# Altium project CapProtector.PrjPCB
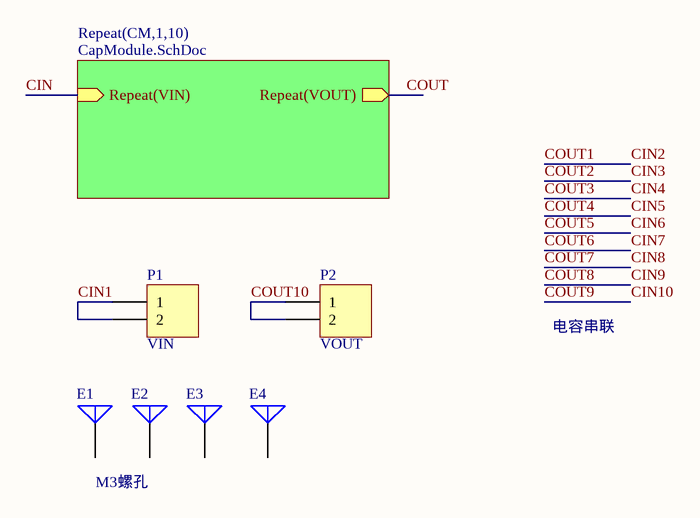
[diagram p0: CapProtector.SchDoc]
2 sheets, 116 parts. Net scope: hierarchical (ports join the sheet entries above them; power ports are global).
Board file: CapProtector.PcbDoc
Sheets:
  CapProtector.SchDoc
    CM1 = CapModule.SchDoc
    CM2 = CapModule.SchDoc
    CM3 = CapModule.SchDoc
    CM4 = CapModule.SchDoc
    CM5 = CapModule.SchDoc
    CM6 = CapModule.SchDoc
    CM7 = CapModule.SchDoc
    CM8 = CapModule.SchDoc
    CM9 = CapModule.SchDoc
    CM10 = CapModule.SchDoc

## Sheet CapProtector.SchDoc
size A4

### Parts
E1  Antenna  [M3x4_N]  (value not drawn)
E2  Antenna  [M3x4_N]  (value not drawn)
E3  Antenna  [M3x4_N]  (value not drawn)
E4  Antenna  [M3x4_N]  (value not drawn)
P1  VIN  [XT30U-M]
P2  VOUT  [XT30U-F]

### Sub-sheets
Repeat(CM,1,10) = CapModule.SchDoc: Repeat(VIN) (in), Repeat(VOUT) (out)

### Nets
CIN: sheet Repeat(CM,1,10)/Repeat(VIN)
CIN1: P1.1 P1.2
COUT: sheet Repeat(CM,1,10)/Repeat(VOUT)
COUT10: P2.1 P2.2

Not connected (* = marked no-connect by the designer): E1 1(A); E2 1(A); E3 1(A); E4 1(A)

### Notes on the sheet
- 电容串联
- M3螺孔

### Library data of the parts
E1-E4 = Antenna: Generic Antenna; Published: 24-Mar-1999; LatestRevisionDate: 17-Jul-2002; LatestRevisionNote: Re-released for DXP Platform.; PackageReference: PIN1; Publisher: Altium Limited
P1 P2 = Header 2: Header, 2-Pin; LatestRevisionDate: 17-Jul-2002; LatestRevisionNote: Re-released for DXP Platform.; Publisher: Altium Limited

## Sheet CapModule.SchDoc
size A4
Used 10 times, as channels CM1, CM2, CM3, CM4, CM5, CM6, CM7, CM8, CM9, CM10. Parts and nets are listed once, with the designators drawn on the sheet.
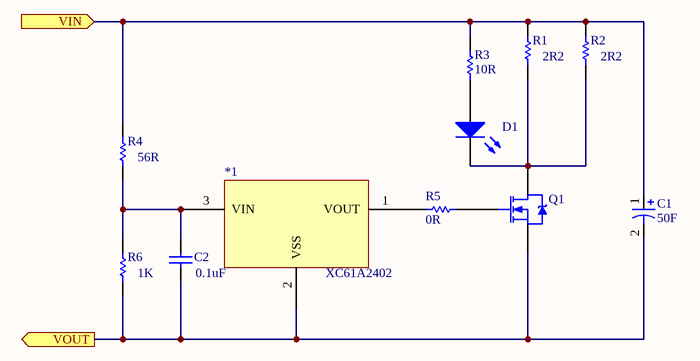
[diagram p1: CapModule.SchDoc]

### Parts
*1  XC61A2402  [SOT23-3N]
C1  value 50F  [CAP 7.5*18*35.5 - GD]  (hidden comment: Cap Pol1)
C2  value 0.1uF  [0603C]  (hidden comment: Cap)
D1  LED0  [LED 0603B]  (value not drawn)
Q1  NMOS-2  [sot23]  (value not drawn)
R1  value 2R2  [2512R]  (hidden comment: Res1)
R2  value 2R2  [2512R]  (hidden comment: Res1)
R3  value 10R  [0603R]  (hidden comment: Res1)
R4  value 56R  [0603R]  (hidden comment: Res1)
R5  value 0R  [0603R]  (hidden comment: Res1)
R6  value 1K  [0603R]  (hidden comment: Res1)

### Ports
VIN (in), VOUT (out)

### Nets
VIN: C1.1 R1.2 R2.2 R3.1 R4.2 ; port VIN
VOUT: *1.2(VSS) C1.2 C2.1 Q1.3(S) R6.1 ; port VOUT
Net*1_1: *1.1(VOUT) R5.2
Net*1_3: *1.3(VIN) C2.2 R4.1 R6.2
NetD1_1: D1.1(A) R3.2
NetD1_2: D1.2(K) Q1.2(D) R1.1 R2.1
NetQ1_1: Q1.1(G) R5.1

### Channels
CM1: designators end in A; ports VIN=CIN1 VOUT=CIN2
CM2: designators end in B; ports VIN=CIN2 VOUT=CIN3
CM3: designators end in C; ports VIN=CIN3 VOUT=CIN4
CM4: designators end in D; ports VIN=CIN4 VOUT=CIN5
CM5: designators end in E; ports VIN=CIN5 VOUT=CIN6
CM6: designators end in F; ports VIN=CIN6 VOUT=CIN7
CM7: designators end in G; ports VIN=CIN7 VOUT=CIN8
CM8: designators end in H; ports VIN=CIN8 VOUT=CIN9
CM9: designators end in I; ports VIN=CIN9 VOUT=CIN10
CM10: designators end in J; ports VIN=CIN10 VOUT=COUT10

### Library data of the parts
*1 = XC61A
C1 = Cap Pol1: Polarized Capacitor (Radial) 2.7v; Published: 8-Jun-2000; LatestRevisionDate: 17-Jul-2002; LatestRevisionNote: Re-released for DXP Platform.; PackageReference: RB7.6-15; Publisher: Altium Limited; PackageDescription: Polarized Capacitor (Radial); 2 Leads
C2 = Cap: Capacitor; Published: 8-Jun-2000; LatestRevisionDate: 17-Jul-2002; LatestRevisionNote: Re-released for DXP Platform.; PackageReference: RAD-0.3; Publisher: Altium Limited; PackageDescription: Radial Cap, Thru-Hole; 2 Leads; 0.3 in Pin Spacing
D1 = LED0: Typical INFRARED GaAs LED; Published: 8-Jun-2000; LatestRevisionDate: 08-Jul-2005; LatestRevisionNote: Mech Layer 1 removed.; PackageReference: LED-0; Publisher: Altium Limited; PackageDescription: LED; 2 Leads
Q1 = NMOS-2: IRLML2502PbF; Note: Pin 2 is electrically connected to pin 4.; Published: 8-Jun-2000; LatestRevisionDate: 17-Jul-2002; LatestRevisionNote: Re-released for DXP Platform.; DatasheetVersion: PD-9.814; PackageVersion: Feb-1997; PackageReference: TO-220AB; Publisher: Altium Limited; PackageDescription: TO, Thru-Hole, Vertical, Heatsink Mounted; 3 In-Line Leads; Pitch 2.54 mm; ComponentLink1Description: Manufacturer Link; ComponentLink1URL: http://www.irf.com/
R1-R6 = Res1: Resistor; Published: 8-Jun-2000; LatestRevisionDate: 17-Jul-2002; LatestRevisionNote: Re-released for DXP Platform.; PackageReference: AXIAL-0.3; Publisher: Altium Limited; PackageDescription: Axial Device, Thru-Hole; 2 Leads; 0.3 in Pin Spacing

## Nets that join several sheets
CIN1: CapProtector (P1.1 P1.2), CM1 (5 pins)
CIN2: CM1 (5 pins), CM2 (5 pins)
CIN3: CM2 (5 pins), CM3 (5 pins)
CIN4: CM3 (5 pins), CM4 (5 pins)
CIN5: CM4 (5 pins), CM5 (5 pins)
CIN6: CM5 (5 pins), CM6 (5 pins)
CIN7: CM6 (5 pins), CM7 (5 pins)
CIN8: CM7 (5 pins), CM8 (5 pins)
CIN9: CM8 (5 pins), CM9 (5 pins)
CIN10: CM9 (5 pins), CM10 (5 pins)
COUT10: CapProtector (P2.1 P2.2), CM10 (5 pins)